# Altium schematic sheet FPGA_U1_Auto.SchDoc
size A2; Generated From FPGA Project: WeatherChannel.PrjFpg; UNUSED_SPECIAL: RouteSeparate; UNUSED_IO: NoERC; VREF: NoERC; UNUSED_INPUT: NoERC; DocumentNumber: 11; SheetNumber: 11; SheetTotal: 11
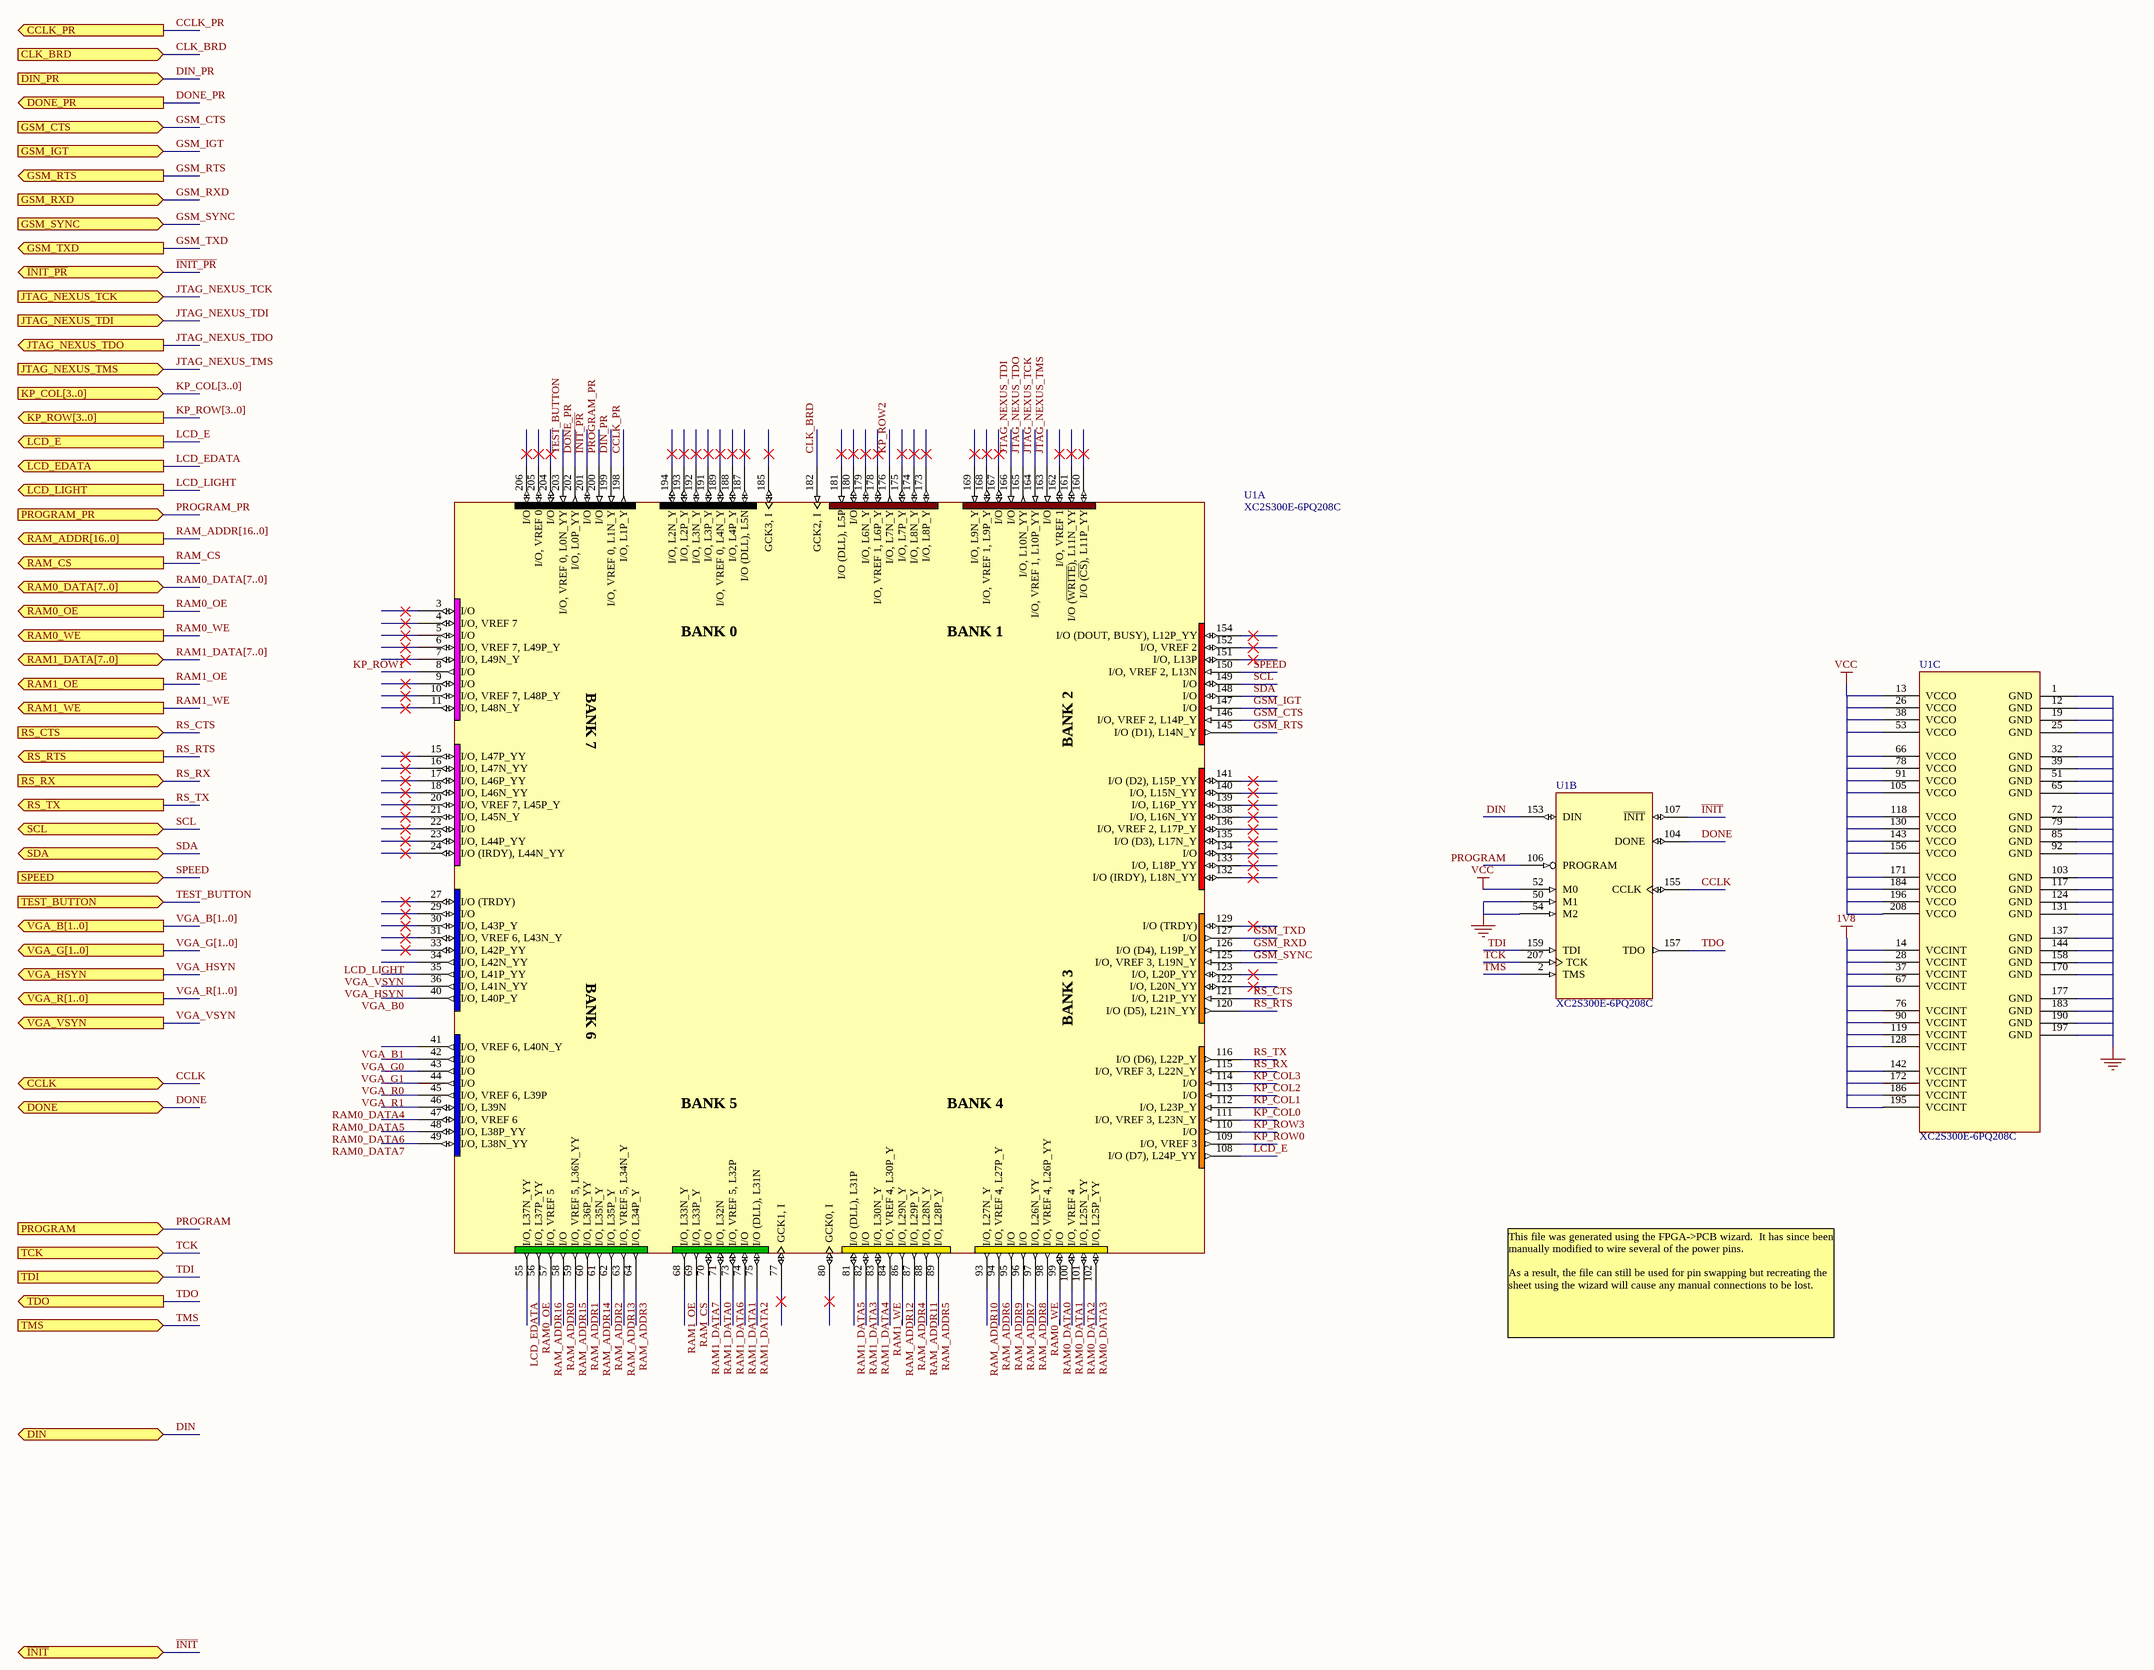
[diagram p0: FPGA_U1_Auto.SchDoc]

## Parts
U1  XC2S300E-6PQ208C  [PQ208]  (parts A,B,C of 3)

## Ports
CCLK (bidir), CCLK_PR (out), CLK_BRD (in), DIN (bidir), DIN_PR (in), DONE (bidir), DONE_PR (out), GSM_CTS (in), GSM_IGT (in), GSM_RTS (out), GSM_RXD (in), GSM_SYNC (in), GSM_TXD (out), JTAG_NEXUS_TCK (in), JTAG_NEXUS_TDI (in), JTAG_NEXUS_TDO (out), JTAG_NEXUS_TMS (in), KP_COL[3..0] (in), KP_ROW[3..0] (out), LCD_E (out), LCD_EDATA (out), LCD_LIGHT (out), PROGRAM (in), PROGRAM_PR (in), RAM0_DATA[7..0] (bidir), RAM0_OE (out), RAM0_WE (out), RAM1_DATA[7..0] (bidir), RAM1_OE (out), RAM1_WE (out), RAM_ADDR[16..0] (out), RAM_CS (out), RS_CTS (in), RS_RTS (out), RS_RX (in), RS_TX (out), SCL (bidir), SDA (bidir), SPEED (in), TCK (in), TDI (in), TDO (out), TEST_BUTTON (in), TMS (in), VGA_B[1..0] (out), VGA_G[1..0] (out), VGA_HSYN (out), VGA_R[1..0] (out), VGA_VSYN (out), ~{INIT_PR} (bidir), ~{INIT} (bidir)

## Nets
1V8: U1.14(VCCINT) U1.28(VCCINT) U1.37(VCCINT) U1.67(VCCINT) U1.76(VCCINT) U1.90(VCCINT) U1.119(VCCINT) U1.128(VCCINT) U1.142(VCCINT) U1.172(VCCINT) U1.186(VCCINT) U1.195(VCCINT)
GND: U1.1(GND) U1.12(GND) U1.19(GND) U1.25(GND) U1.32(GND) U1.39(GND) U1.50(M1) U1.51(GND) U1.54(M2) U1.65(GND) U1.72(GND) U1.79(GND) U1.85(GND) U1.92(GND) U1.103(GND) U1.117(GND) U1.124(GND) U1.131(GND) U1.137(GND) U1.144(GND) U1.158(GND) U1.170(GND) U1.177(GND) U1.183(GND) U1.190(GND) U1.197(GND)
VCC: U1.13(VCCO) U1.26(VCCO) U1.38(VCCO) U1.52(M0) U1.53(VCCO) U1.66(VCCO) U1.78(VCCO) U1.91(VCCO) U1.105(VCCO) U1.118(VCCO) U1.130(VCCO) U1.143(VCCO) U1.156(VCCO) U1.171(VCCO) U1.184(VCCO) U1.196(VCCO) U1.208(VCCO)
CCLK: U1.155(CCLK) ; port CCLK
CCLK_PR: U1.198(I/O,_L1P_Y) ; port CCLK_PR
CLK_BRD: U1.182(GCK2,_I) ; port CLK_BRD
DIN: U1.153(DIN) ; port DIN
DIN_PR: U1.199(I/O,_VREF_0,_L1N_Y) ; port DIN_PR
DONE: U1.104(DONE) ; port DONE
DONE_PR: U1.202(I/O,_L0P_YY) ; port DONE_PR
GSM_CTS: U1.146(I/O,_VREF_2,_L14P_Y) ; port GSM_CTS
GSM_IGT: U1.147(I/O) ; port GSM_IGT
GSM_RTS: U1.145(I/O_(D1),_L14N_Y) ; port GSM_RTS
GSM_RXD: U1.126(I/O_(D4),_L19P_Y) ; port GSM_RXD
GSM_SYNC: U1.125(I/O,_VREF_3,_L19N_Y) ; port GSM_SYNC
GSM_TXD: U1.127(I/O) ; port GSM_TXD
~{INIT}: U1.107(~{INIT}) ; port ~{INIT}
~{INIT_PR}: U1.201(I/O) ; port ~{INIT_PR}
JTAG_NEXUS_TCK: U1.164(I/O,_VREF_1,_L10P_YY) ; port JTAG_NEXUS_TCK
JTAG_NEXUS_TDI: U1.166(I/O) ; port JTAG_NEXUS_TDI
JTAG_NEXUS_TDO: U1.165(I/O,_L10N_YY) ; port JTAG_NEXUS_TDO
JTAG_NEXUS_TMS: U1.163(I/O) ; port JTAG_NEXUS_TMS
KP_COL0: U1.111(I/O,_VREF_3,_L23N_Y)
KP_COL1: U1.112(I/O,_L23P_Y)
KP_COL2: U1.113(I/O)
KP_COL3: U1.114(I/O)
KP_ROW0: U1.109(I/O,_VREF_3)
KP_ROW1: U1.8(I/O)
KP_ROW2: U1.176(I/O,_L7N_Y)
KP_ROW3: U1.110(I/O)
LCD_E: U1.108(I/O_(D7),_L24P_YY) ; port LCD_E
LCD_EDATA: U1.55(I/O,_L37N_YY) ; port LCD_EDATA
LCD_LIGHT: U1.34(I/O,_L42N_YY) ; port LCD_LIGHT
PROGRAM: U1.106(PROGRAM) ; port PROGRAM
PROGRAM_PR: U1.200(I/O) ; port PROGRAM_PR
RAM0_DATA0: U1.99(I/O)
RAM0_DATA1: U1.100(I/O,_VREF_4)
RAM0_DATA2: U1.101(I/O,_L25N_YY)
RAM0_DATA3: U1.102(I/O,_L25P_YY)
RAM0_DATA4: U1.46(I/O,_L39N)
RAM0_DATA5: U1.47(I/O,_VREF_6)
RAM0_DATA6: U1.48(I/O,_L38P_YY)
RAM0_DATA7: U1.49(I/O,_L38N_YY)
RAM0_OE: U1.56(I/O,_L37P_YY) ; port RAM0_OE
RAM0_WE: U1.98(I/O,_VREF_4,_L26P_YY) ; port RAM0_WE
RAM1_DATA0: U1.71(I/O,_L32N)
RAM1_DATA1: U1.74(I/O)
RAM1_DATA2: U1.75(I/O_(DLL),_L31N)
RAM1_DATA3: U1.82(I/O)
RAM1_DATA4: U1.83(I/O,_L30N_Y)
RAM1_DATA5: U1.81(I/O_(DLL),_L31P)
RAM1_DATA6: U1.73(I/O,_VREF_5,_L32P)
RAM1_DATA7: U1.70(I/O)
RAM1_OE: U1.68(I/O,_L33N_Y) ; port RAM1_OE
RAM1_WE: U1.84(I/O,_VREF_4,_L30P_Y) ; port RAM1_WE
RAM_ADDR0: U1.58(I/O)
RAM_ADDR1: U1.60(I/O,_L36P_YY)
RAM_ADDR2: U1.62(I/O,_L35P_Y)
RAM_ADDR3: U1.64(I/O,_L34P_Y)
RAM_ADDR4: U1.87(I/O,_L29P_Y)
RAM_ADDR5: U1.89(I/O,_L28P_Y)
RAM_ADDR6: U1.94(I/O,_VREF_4,_L27P_Y)
RAM_ADDR7: U1.96(I/O)
RAM_ADDR8: U1.97(I/O,_L26N_YY)
RAM_ADDR9: U1.95(I/O)
RAM_ADDR10: U1.93(I/O,_L27N_Y)
RAM_ADDR11: U1.88(I/O,_L28N_Y)
RAM_ADDR12: U1.86(I/O,_L29N_Y)
RAM_ADDR13: U1.63(I/O,_VREF_5,_L34N_Y)
RAM_ADDR14: U1.61(I/O,_L35N_Y)
RAM_ADDR15: U1.59(I/O,_VREF_5,_L36N_YY)
RAM_ADDR16: U1.57(I/O,_VREF_5)
RAM_CS: U1.69(I/O,_L33P_Y) ; port RAM_CS
RS_CTS: U1.121(I/O,_L21P_YY) ; port RS_CTS
RS_RTS: U1.120(I/O_(D5),_L21N_YY) ; port RS_RTS
RS_RX: U1.115(I/O,_VREF_3,_L22N_Y) ; port RS_RX
RS_TX: U1.116(I/O_(D6),_L22P_Y) ; port RS_TX
SCL: U1.149(I/O) ; port SCL
SDA: U1.148(I/O) ; port SDA
SPEED: U1.150(I/O,_VREF_2,_L13N) ; port SPEED
TCK: U1.207(TCK) ; port TCK
TDI: U1.159(TDI) ; port TDI
TDO: U1.157(TDO) ; port TDO
TEST_BUTTON: U1.203(I/O,_VREF_0,_L0N_YY) ; port TEST_BUTTON
TMS: U1.2(TMS) ; port TMS
VGA_B0: U1.40(I/O,_L40P_Y)
VGA_B1: U1.41(I/O,_VREF_6,_L40N_Y)
VGA_G0: U1.42(I/O)
VGA_G1: U1.43(I/O)
VGA_HSYN: U1.36(I/O,_L41N_YY) ; port VGA_HSYN
VGA_R0: U1.44(I/O)
VGA_R1: U1.45(I/O,_VREF_6,_L39P)
VGA_VSYN: U1.35(I/O,_L41P_YY) ; port VGA_VSYN

Not connected (* = marked no-connect by the designer): U1 3(I/O)* 4(I/O,_VREF_7)* 5(I/O)* 6(I/O,_VREF_7,_L49P_Y)* 7(I/O,_L49N_Y)* 9(I/O)* 10(I/O,_VREF_7,_L48P_Y)* 11(I/O,_L48N_Y)* 15(I/O,_L47P_YY)* 16(I/O,_L47N_YY)* 17(I/O,_L46P_YY)* 18(I/O,_L46N_YY)* 20(I/O,_VREF_7,_L45P_Y)* 21(I/O,_L45N_Y)* 22(I/O)* 23(I/O,_L44P_YY)* 24(I/O_(IRDY),_L44N_YY)* 27(I/O_(TRDY))* 29(I/O)* 30(I/O,_L43P_Y)* 31(I/O,_VREF_6,_L43N_Y)* 33(I/O,_L42P_YY)* 77(GCK1,_I)* 80(GCK0,_I)* 122(I/O,_L20N_YY)* 123(I/O,_L20P_YY)* 129(I/O_(TRDY))* 132(I/O_(IRDY),_L18N_YY)* 133(I/O,_L18P_YY)* 134(I/O)* 135(I/O_(D3),_L17N_Y)* 136(I/O,_VREF_2,_L17P_Y)* 138(I/O,_L16N_YY)* 139(I/O,_L16P_YY)* 140(I/O,_L15N_YY)* 141(I/O_(D2),_L15P_YY)* 151(I/O,_L13P)* 152(I/O,_VREF_2)* 154(I/O_(DOUT,_BUSY),_L12P_YY)* 160(I/O_(~{CS}),_L11P_YY)* 161(I/O_(~{WRITE}),_L11N_YY)* 162(I/O,_VREF_1)* 167(I/O)* 168(I/O,_VREF_1,_L9P_Y)* 169(I/O,_L9N_Y)* 173(I/O,_L8P_Y)* 174(I/O,_L8N_Y)* 175(I/O,_L7P_Y)* 178(I/O,_VREF_1,_L6P_Y)* 179(I/O,_L6N_Y)* 180(I/O)* 181(I/O_(DLL),_L5P)* 185(GCK3,_I)* 187(I/O_(DLL),_L5N)* 188(I/O,_L4P_Y)* 189(I/O,_VREF_0,_L4N_Y)* 191(I/O,_L3P_Y)* 192(I/O,_L3N_Y)* 193(I/O,_L2P_Y)* 194(I/O,_L2N_Y)* 204(I/O)* 205(I/O,_VREF_0)* 206(I/O)*

## Buses and harness runs
bus KP_COL[3..0] = port KP_COL[3..0]
bus KP_ROW[3..0] = port KP_ROW[3..0]
bus RAM0_DATA[7..0] = port RAM0_DATA[7..0]
bus RAM1_DATA[7..0] = port RAM1_DATA[7..0]
bus RAM_ADDR[16..0] = port RAM_ADDR[16..0]
bus VGA_B[1..0] = port VGA_B[1..0]
bus VGA_G[1..0] = port VGA_G[1..0]
bus VGA_R[1..0] = port VGA_R[1..0]

## Notes on the sheet
- This file was generated using the FPGA->PCB wizard.  It has since been manually modified to wire several of the power pins.
  As a result, the file can still be used for pin swapping but recreating the sheet using the wizard will cause any manual connections to be lost.
- (in symbol XC2S300E-6PQ208C, part A) BANK 0; BANK 1; BANK 7; BANK 2; BANK 6; BANK 3; BANK 5; BANK 4

## Library data of the parts
U1 = XC2S300E-6PQ208C: Spartan-IIE 1.8V FPGA, 208-Pin PQFP, Standard Performance, Commercial Grade; Package Information: Latest Revision: ver1.1, Oct-2002; Code - JEDEC: MS-029-FA-1; Published: 19-Jul-2002; Revision: 17-Sep-2003: Pin names updated to match datasheet, ver2.1.; Datasheet: Latest Revision: 09-Jul-2003; Package Reference: PQ208; Publisher: Altium Limited